# Altium schematic sheet 15 EXP_IO.SchDoc
size 513 x 386 mm
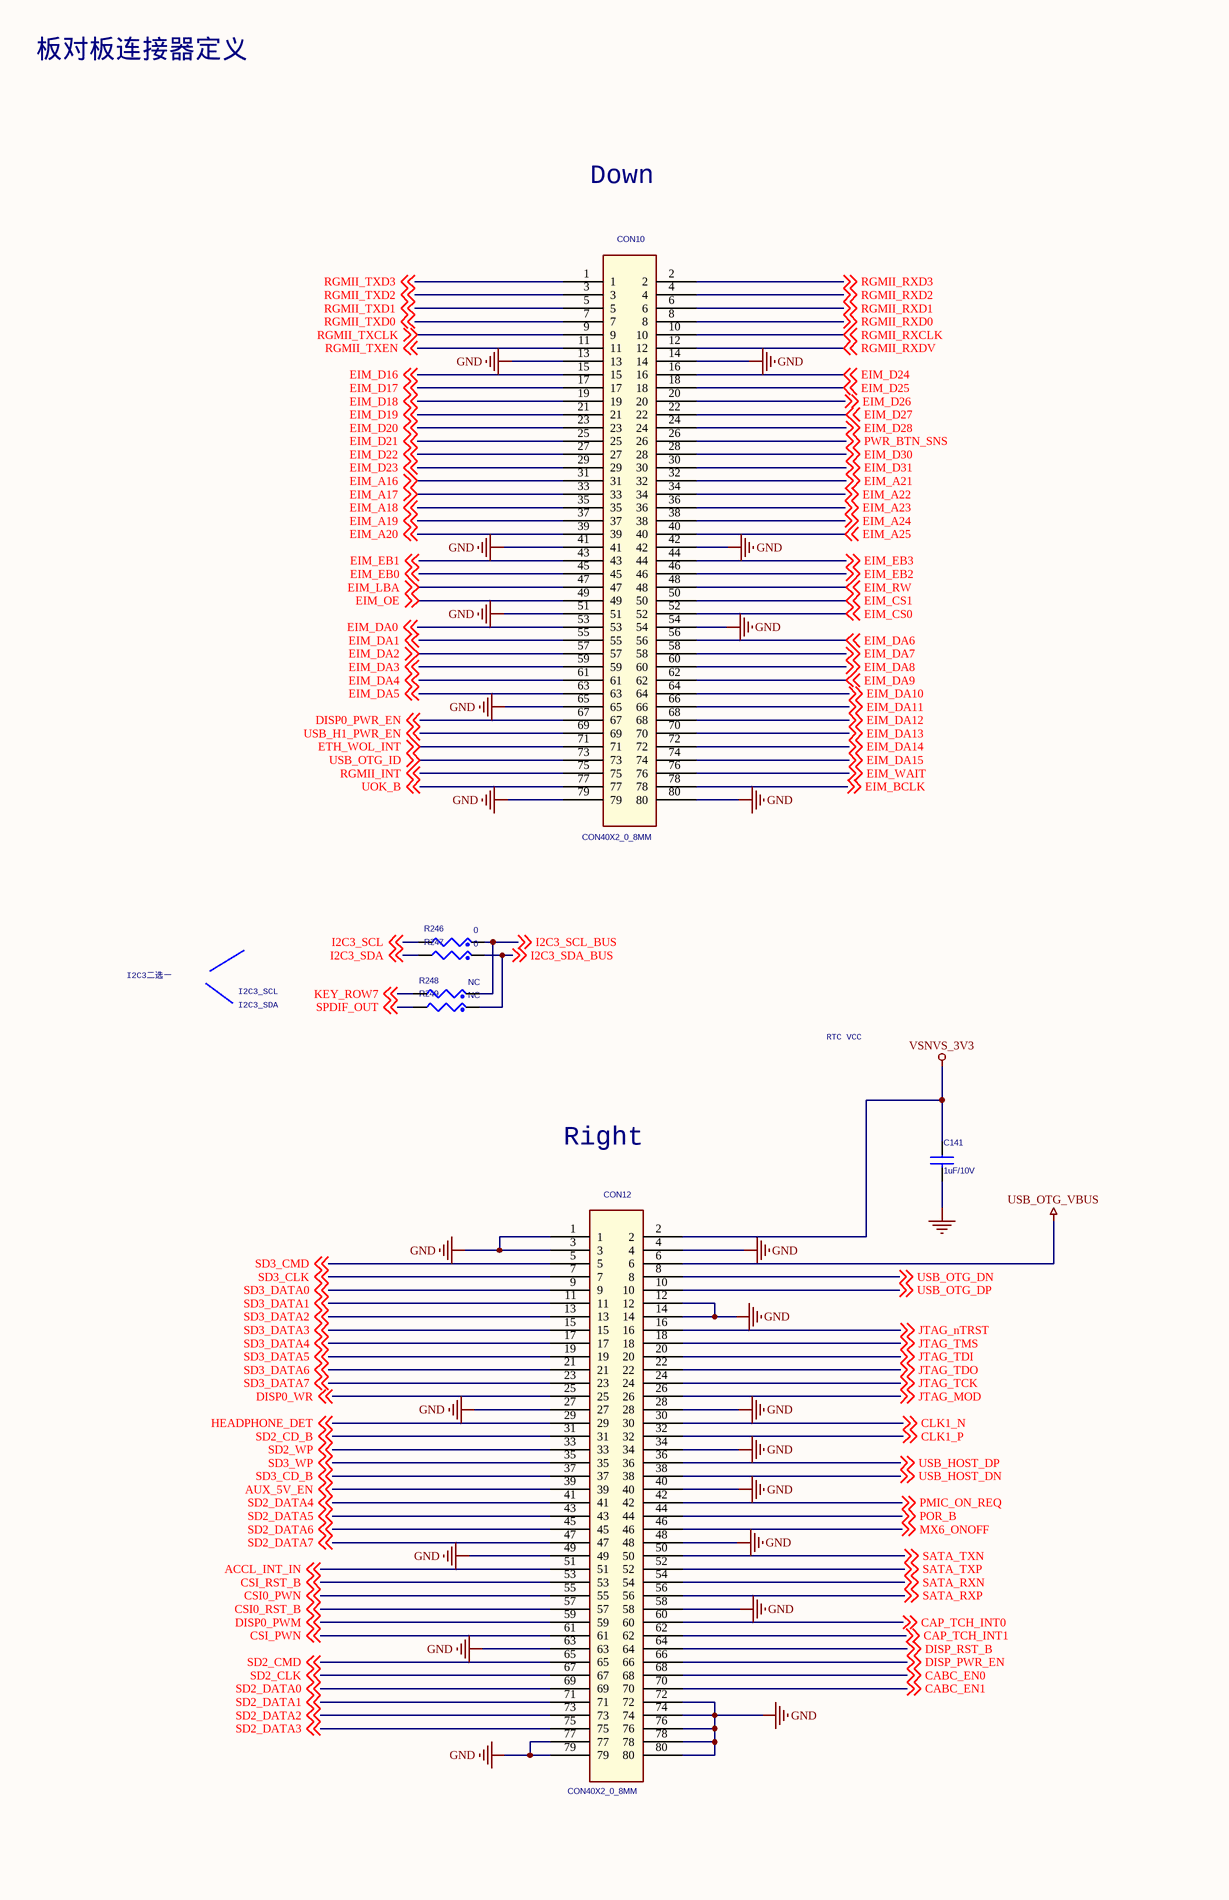
[diagram p0: 15 EXP_IO.SchDoc, left]
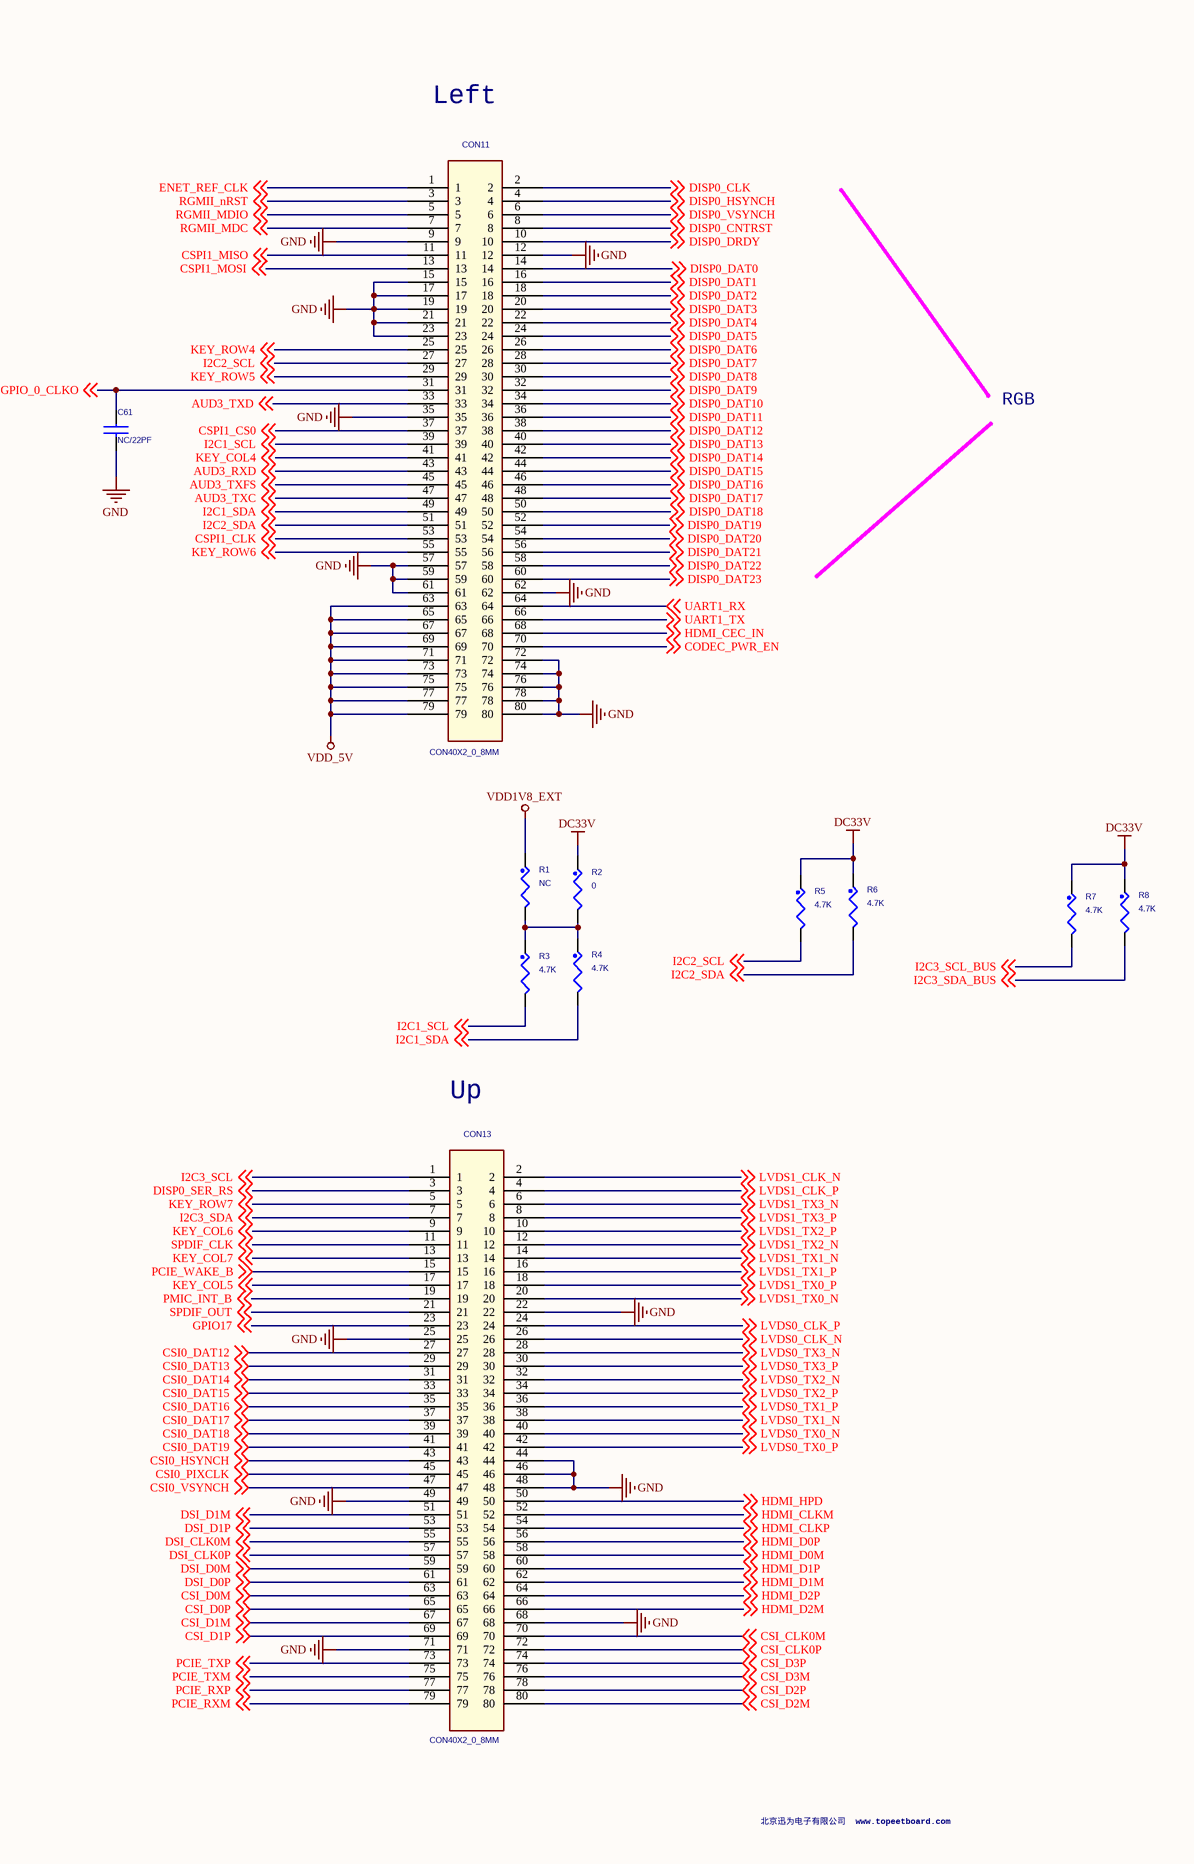
[diagram p1: 15 EXP_IO.SchDoc, right]

## Parts
C61  NC/22PF  [C0603]
C141  1uF/10V  [C0603]
CON10  CON40X2_0_8MM  [CON40X2_0_8MM]
CON11  CON40X2_0_8MM  [CON40X2_0_8MM]
CON12  CON40X2_0_8MM  [CON40X2_0_8MM]
CON13  CON40X2_0_8MM  [CON40X2_0_8MM]
R1  NC  [R0402]
R2  0  [R0402]
R3  4.7K  [R0402]
R4  4.7K  [R0402]
R5  4.7K  [R0402]
R6  4.7K  [R0402]
R7  4.7K  [R0402]
R8  4.7K  [R0402]
R246  0  [R0402]
R247  0  [R0402]
R248  NC  [R0402]
R249  NC  [R0402]

## Nets
DC33V: R2.1 R5.1 R6.1 R7.1 R8.1
GND: C61.2 C141.2 CON10.13 CON10.14 CON10.41 CON10.42 CON10.51 CON10.54 CON10.65 CON10.79 CON10.80 CON11.9 CON11.12 CON11.15 CON11.17 CON11.19 CON11.21 CON11.23 CON11.35 CON11.57 CON11.59 CON11.61 CON11.62 CON11.72 CON11.74 CON11.76 CON11.78 CON11.80 CON12.1 CON12.3 CON12.4 CON12.12 CON12.14 CON12.27 CON12.28 CON12.34 CON12.40 CON12.48 CON12.49 CON12.58 CON12.63 CON12.72 CON12.74 CON12.76 CON12.77 CON12.78 CON12.79 CON12.80 CON13.22 CON13.25 CON13.44 CON13.46 CON13.48 CON13.49 CON13.68 CON13.71
USB_OTG_VBUS: CON12.6
VDD1V8_EXT: R1.1
VDD_5V: CON11.63 CON11.65 CON11.67 CON11.69 CON11.71 CON11.73 CON11.75 CON11.77 CON11.79
VSNVS_3V3: C141.1 CON12.2
ACCL_INT_IN: CON12.51 ; off-sheet ACCL_INT_IN
AUD3_RXD: CON11.43 ; off-sheet AUD3_RXD
AUD3_TXC: CON11.47 ; off-sheet AUD3_TXC
AUD3_TXD: CON11.33 ; off-sheet AUD3_TXD
AUD3_TXFS: CON11.45 ; off-sheet AUD3_TXFS
AUX_5V_EN: CON12.39 ; off-sheet AUX_5V_EN
CABC_EN0: CON12.68 ; off-sheet CABC_EN0
CABC_EN1: CON12.70 ; off-sheet CABC_EN1
CAP_TCH_INT0: CON12.60 ; off-sheet CAP_TCH_INT0
CAP_TCH_INT1: CON12.62 ; off-sheet CAP_TCH_INT1
CLK1_N: CON12.30 ; off-sheet CLK1_N
CLK1_P: CON12.32 ; off-sheet CLK1_P
CODEC_PWR_EN: CON11.70 ; off-sheet CODEC_PWR_EN
CSI0_DAT12: CON13.27 ; off-sheet CSI0_DAT12
CSI0_DAT13: CON13.29 ; off-sheet CSI0_DAT13
CSI0_DAT14: CON13.31 ; off-sheet CSI0_DAT14
CSI0_DAT15: CON13.33 ; off-sheet CSI0_DAT15
CSI0_DAT16: CON13.35 ; off-sheet CSI0_DAT16
CSI0_DAT17: CON13.37 ; off-sheet CSI0_DAT17
CSI0_DAT18: CON13.39 ; off-sheet CSI0_DAT18
CSI0_DAT19: CON13.41 ; off-sheet CSI0_DAT19
CSI0_HSYNCH: CON13.43 ; off-sheet CSI0_HSYNCH
CSI0_PIXCLK: CON13.45 ; off-sheet CSI0_PIXCLK
CSI0_PWN: CON12.55 ; off-sheet CSI0_PWN
CSI0_RST_B: CON12.57 ; off-sheet CSI0_RST_B
CSI0_VSYNCH: CON13.47 ; off-sheet CSI0_VSYNCH
CSI_CLK0M: CON13.70 ; off-sheet CSI_CLK0M
CSI_CLK0P: CON13.72 ; off-sheet CSI_CLK0P
CSI_D0M: CON13.63 ; off-sheet CSI_D0M
CSI_D0P: CON13.65 ; off-sheet CSI_D0P
CSI_D1M: CON13.67 ; off-sheet CSI_D1M
CSI_D1P: CON13.69 ; off-sheet CSI_D1P
CSI_D2M: CON13.80 ; off-sheet CSI_D2M
CSI_D2P: CON13.78 ; off-sheet CSI_D2P
CSI_D3M: CON13.76 ; off-sheet CSI_D3M
CSI_D3P: CON13.74 ; off-sheet CSI_D3P
CSI_PWN: CON12.61 ; off-sheet CSI_PWN
CSI_RST_B: CON12.53 ; off-sheet CSI_RST_B
CSPI1_CLK: CON11.53 ; off-sheet CSPI1_CLK
CSPI1_CS0: CON11.37 ; off-sheet CSPI1_CS0
CSPI1_MISO: CON11.11 ; off-sheet CSPI1_MISO
CSPI1_MOSI: CON11.13 ; off-sheet CSPI1_MOSI
DISP0_CLK: CON11.2 ; off-sheet DISP0_CLK
DISP0_CNTRST: CON11.8 ; off-sheet DISP0_CNTRST
DISP0_DAT0: CON11.14 ; off-sheet DISP0_DAT0
DISP0_DAT1: CON11.16 ; off-sheet DISP0_DAT1
DISP0_DAT2: CON11.18 ; off-sheet DISP0_DAT2
DISP0_DAT3: CON11.20 ; off-sheet DISP0_DAT3
DISP0_DAT4: CON11.22 ; off-sheet DISP0_DAT4
DISP0_DAT5: CON11.24 ; off-sheet DISP0_DAT5
DISP0_DAT6: CON11.26 ; off-sheet DISP0_DAT6
DISP0_DAT7: CON11.28 ; off-sheet DISP0_DAT7
DISP0_DAT8: CON11.30 ; off-sheet DISP0_DAT8
DISP0_DAT9: CON11.32 ; off-sheet DISP0_DAT9
DISP0_DAT10: CON11.34 ; off-sheet DISP0_DAT10
DISP0_DAT11: CON11.36 ; off-sheet DISP0_DAT11
DISP0_DAT12: CON11.38 ; off-sheet DISP0_DAT12
DISP0_DAT13: CON11.40 ; off-sheet DISP0_DAT13
DISP0_DAT14: CON11.42 ; off-sheet DISP0_DAT14
DISP0_DAT15: CON11.44 ; off-sheet DISP0_DAT15
DISP0_DAT16: CON11.46 ; off-sheet DISP0_DAT16
DISP0_DAT17: CON11.48 ; off-sheet DISP0_DAT17
DISP0_DAT18: CON11.50 ; off-sheet DISP0_DAT18
DISP0_DAT19: CON11.52 ; off-sheet DISP0_DAT19
DISP0_DAT20: CON11.54 ; off-sheet DISP0_DAT20
DISP0_DAT21: CON11.56 ; off-sheet DISP0_DAT21
DISP0_DAT22: CON11.58 ; off-sheet DISP0_DAT22
DISP0_DAT23: CON11.60 ; off-sheet DISP0_DAT23
DISP0_DRDY: CON11.10 ; off-sheet DISP0_DRDY
DISP0_HSYNCH: CON11.4 ; off-sheet DISP0_HSYNCH
DISP0_PWM: CON12.59 ; off-sheet DISP0_PWM
DISP0_PWR_EN: CON10.67 ; off-sheet DISP0_PWR_EN
DISP0_SER_RS: CON13.3 ; off-sheet DISP0_SER_RS
DISP0_VSYNCH: CON11.6 ; off-sheet DISP0_VSYNCH
DISP0_WR: CON12.25 ; off-sheet DISP0_WR
DISP_PWR_EN: CON12.66 ; off-sheet DISP_PWR_EN
DISP_RST_B: CON12.64 ; off-sheet DISP_RST_B
DSI_CLK0M: CON13.55 ; off-sheet DSI_CLK0M
DSI_CLK0P: CON13.57 ; off-sheet DSI_CLK0P
DSI_D0M: CON13.59 ; off-sheet DSI_D0M
DSI_D0P: CON13.61 ; off-sheet DSI_D0P
DSI_D1M: CON13.51 ; off-sheet DSI_D1M
DSI_D1P: CON13.53 ; off-sheet DSI_D1P
EIM_A16: CON10.31 ; off-sheet EIM_A16
EIM_A17: CON10.33 ; off-sheet EIM_A17
EIM_A18: CON10.35 ; off-sheet EIM_A18
EIM_A19: CON10.37 ; off-sheet EIM_A19
EIM_A20: CON10.39 ; off-sheet EIM_A20
EIM_A21: CON10.32 ; off-sheet EIM_A21
EIM_A22: CON10.34 ; off-sheet EIM_A22
EIM_A23: CON10.36 ; off-sheet EIM_A23
EIM_A24: CON10.38 ; off-sheet EIM_A24
EIM_A25: CON10.40 ; off-sheet EIM_A25
EIM_BCLK: CON10.78 ; off-sheet EIM_BCLK
EIM_CS0: CON10.52 ; off-sheet EIM_CS0
EIM_CS1: CON10.50 ; off-sheet EIM_CS1
EIM_D16: CON10.15 ; off-sheet EIM_D16
EIM_D17: CON10.17 ; off-sheet EIM_D17
EIM_D18: CON10.19 ; off-sheet EIM_D18
EIM_D19: CON10.21 ; off-sheet EIM_D19
EIM_D20: CON10.23 ; off-sheet EIM_D20
EIM_D21: CON10.25 ; off-sheet EIM_D21
EIM_D22: CON10.27 ; off-sheet EIM_D22
EIM_D23: CON10.29 ; off-sheet EIM_D23
EIM_D24: CON10.16 ; off-sheet EIM_D24
EIM_D25: CON10.18 ; off-sheet EIM_D25
EIM_D26: CON10.20 ; off-sheet EIM_D26
EIM_D27: CON10.22 ; off-sheet EIM_D27
EIM_D28: CON10.24 ; off-sheet EIM_D28
EIM_D30: CON10.28 ; off-sheet EIM_D30
EIM_D31: CON10.30 ; off-sheet EIM_D31
EIM_DA0: CON10.53 ; off-sheet EIM_DA0
EIM_DA1: CON10.55 ; off-sheet EIM_DA1
EIM_DA2: CON10.57 ; off-sheet EIM_DA2
EIM_DA3: CON10.59 ; off-sheet EIM_DA3
EIM_DA4: CON10.61 ; off-sheet EIM_DA4
EIM_DA5: CON10.63 ; off-sheet EIM_DA5
EIM_DA6: CON10.56 ; off-sheet EIM_DA6
EIM_DA7: CON10.58 ; off-sheet EIM_DA7
EIM_DA8: CON10.60 ; off-sheet EIM_DA8
EIM_DA9: CON10.62 ; off-sheet EIM_DA9
EIM_DA10: CON10.64 ; off-sheet EIM_DA10
EIM_DA11: CON10.66 ; off-sheet EIM_DA11
EIM_DA12: CON10.68 ; off-sheet EIM_DA12
EIM_DA13: CON10.70 ; off-sheet EIM_DA13
EIM_DA14: CON10.72 ; off-sheet EIM_DA14
EIM_DA15: CON10.74 ; off-sheet EIM_DA15
EIM_EB0: CON10.45 ; off-sheet EIM_EB0
EIM_EB1: CON10.43 ; off-sheet EIM_EB1
EIM_EB2: CON10.46 ; off-sheet EIM_EB2
EIM_EB3: CON10.44 ; off-sheet EIM_EB3
EIM_LBA: CON10.47 ; off-sheet EIM_LBA
EIM_OE: CON10.49 ; off-sheet EIM_OE
EIM_RW: CON10.48 ; off-sheet EIM_RW
EIM_WAIT: CON10.76 ; off-sheet EIM_WAIT
ENET_REF_CLK: CON11.1 ; off-sheet ENET_REF_CLK
ETH_WOL_INT: CON10.71 ; off-sheet ETH_WOL_INT
GPIO17: CON13.23 ; off-sheet GPIO17
GPIO_0_CLKO: C61.1 CON11.31 ; off-sheet GPIO_0_CLKO
HDMI_CEC_IN: CON11.68 ; off-sheet HDMI_CEC_IN
HDMI_CLKM: CON13.52 ; off-sheet HDMI_CLKM
HDMI_CLKP: CON13.54 ; off-sheet HDMI_CLKP
HDMI_D0M: CON13.58 ; off-sheet HDMI_D0M
HDMI_D0P: CON13.56 ; off-sheet HDMI_D0P
HDMI_D1M: CON13.62 ; off-sheet HDMI_D1M
HDMI_D1P: CON13.60 ; off-sheet HDMI_D1P
HDMI_D2M: CON13.66 ; off-sheet HDMI_D2M
HDMI_D2P: CON13.64 ; off-sheet HDMI_D2P
HDMI_HPD: CON13.50 ; off-sheet HDMI_HPD
HEADPHONE_DET: CON12.29 ; off-sheet HEADPHONE_DET
I2C1_SCL: CON11.39 R3.2 ; off-sheet I2C1_SCL
I2C1_SDA: CON11.49 R4.2 ; off-sheet I2C1_SDA
I2C2_SCL: CON11.27 R5.2 ; off-sheet I2C2_SCL
I2C2_SDA: CON11.51 R6.2 ; off-sheet I2C2_SDA
I2C3_SCL: CON13.1 R246.2 ; off-sheet I2C3_SCL
I2C3_SCL_BUS: R7.2 R246.1 R248.1 ; off-sheet I2C3_SCL_BUS
I2C3_SDA: CON13.7 R247.2 ; off-sheet I2C3_SDA
I2C3_SDA_BUS: R8.2 R247.1 R249.1 ; off-sheet I2C3_SDA_BUS
JTAG_MOD: CON12.26 ; off-sheet JTAG_MOD
JTAG_nTRST: CON12.16 ; off-sheet JTAG_nTRST
JTAG_TCK: CON12.24 ; off-sheet JTAG_TCK
JTAG_TDI: CON12.20 ; off-sheet JTAG_TDI
JTAG_TDO: CON12.22 ; off-sheet JTAG_TDO
JTAG_TMS: CON12.18 ; off-sheet JTAG_TMS
KEY_COL4: CON11.41 ; off-sheet KEY_COL4
KEY_COL5: CON13.17 ; off-sheet KEY_COL5
KEY_COL6: CON13.9 ; off-sheet KEY_COL6
KEY_COL7: CON13.13 ; off-sheet KEY_COL7
KEY_ROW4: CON11.25 ; off-sheet KEY_ROW4
KEY_ROW5: CON11.29 ; off-sheet KEY_ROW5
KEY_ROW6: CON11.55 ; off-sheet KEY_ROW6
KEY_ROW7: CON13.5 R248.2 ; off-sheet KEY_ROW7
LVDS0_CLK_N: CON13.26 ; off-sheet LVDS0_CLK_N
LVDS0_CLK_P: CON13.24 ; off-sheet LVDS0_CLK_P
LVDS0_TX0_N: CON13.40 ; off-sheet LVDS0_TX0_N
LVDS0_TX0_P: CON13.42 ; off-sheet LVDS0_TX0_P
LVDS0_TX1_N: CON13.38 ; off-sheet LVDS0_TX1_N
LVDS0_TX1_P: CON13.36 ; off-sheet LVDS0_TX1_P
LVDS0_TX2_N: CON13.32 ; off-sheet LVDS0_TX2_N
LVDS0_TX2_P: CON13.34 ; off-sheet LVDS0_TX2_P
LVDS0_TX3_N: CON13.28 ; off-sheet LVDS0_TX3_N
LVDS0_TX3_P: CON13.30 ; off-sheet LVDS0_TX3_P
LVDS1_CLK_N: CON13.2 ; off-sheet LVDS1_CLK_N
LVDS1_CLK_P: CON13.4 ; off-sheet LVDS1_CLK_P
LVDS1_TX0_N: CON13.20 ; off-sheet LVDS1_TX0_N
LVDS1_TX0_P: CON13.18 ; off-sheet LVDS1_TX0_P
LVDS1_TX1_N: CON13.14 ; off-sheet LVDS1_TX1_N
LVDS1_TX1_P: CON13.16 ; off-sheet LVDS1_TX1_P
LVDS1_TX2_N: CON13.12 ; off-sheet LVDS1_TX2_N
LVDS1_TX2_P: CON13.10 ; off-sheet LVDS1_TX2_P
LVDS1_TX3_N: CON13.6 ; off-sheet LVDS1_TX3_N
LVDS1_TX3_P: CON13.8 ; off-sheet LVDS1_TX3_P
MX6_ONOFF: CON12.46 ; off-sheet MX6_ONOFF
PCIE_RXM: CON13.79 ; off-sheet PCIE_RXM
PCIE_RXP: CON13.77 ; off-sheet PCIE_RXP
PCIE_TXM: CON13.75 ; off-sheet PCIE_TXM
PCIE_TXP: CON13.73 ; off-sheet PCIE_TXP
PCIE_WAKE_B: CON13.15 ; off-sheet PCIE_WAKE_B
PMIC_INT_B: CON13.19 ; off-sheet PMIC_INT_B
PMIC_ON_REQ: CON12.42 ; off-sheet PMIC_ON_REQ
POR_B: CON12.44 ; off-sheet POR_B
PWR_BTN_SNS: CON10.26 ; off-sheet PWR_BTN_SNS
RGMII_INT: CON10.75 ; off-sheet RGMII_INT
RGMII_MDC: CON11.7 ; off-sheet RGMII_MDC
RGMII_MDIO: CON11.5 ; off-sheet RGMII_MDIO
RGMII_nRST: CON11.3 ; off-sheet RGMII_nRST
RGMII_RXCLK: CON10.10 ; off-sheet RGMII_RXCLK
RGMII_RXD0: CON10.8 ; off-sheet RGMII_RXD0
RGMII_RXD1: CON10.6 ; off-sheet RGMII_RXD1
RGMII_RXD2: CON10.4 ; off-sheet RGMII_RXD2
RGMII_RXD3: CON10.2 ; off-sheet RGMII_RXD3
RGMII_RXDV: CON10.12 ; off-sheet RGMII_RXDV
RGMII_TXCLK: CON10.9 ; off-sheet RGMII_TXCLK
RGMII_TXD0: CON10.7 ; off-sheet RGMII_TXD0
RGMII_TXD1: CON10.5 ; off-sheet RGMII_TXD1
RGMII_TXD2: CON10.3 ; off-sheet RGMII_TXD2
RGMII_TXD3: CON10.1 ; off-sheet RGMII_TXD3
RGMII_TXEN: CON10.11 ; off-sheet RGMII_TXEN
SATA_RXN: CON12.54 ; off-sheet SATA_RXN
SATA_RXP: CON12.56 ; off-sheet SATA_RXP
SATA_TXN: CON12.50 ; off-sheet SATA_TXN
SATA_TXP: CON12.52 ; off-sheet SATA_TXP
SD2_CD_B: CON12.31 ; off-sheet SD2_CD_B
SD2_CLK: CON12.67 ; off-sheet SD2_CLK
SD2_CMD: CON12.65 ; off-sheet SD2_CMD
SD2_DATA0: CON12.69 ; off-sheet SD2_DATA0
SD2_DATA1: CON12.71 ; off-sheet SD2_DATA1
SD2_DATA2: CON12.73 ; off-sheet SD2_DATA2
SD2_DATA3: CON12.75 ; off-sheet SD2_DATA3
SD2_DATA4: CON12.41 ; off-sheet SD2_DATA4
SD2_DATA5: CON12.43 ; off-sheet SD2_DATA5
SD2_DATA6: CON12.45 ; off-sheet SD2_DATA6
SD2_DATA7: CON12.47 ; off-sheet SD2_DATA7
SD2_WP: CON12.33 ; off-sheet SD2_WP
SD3_CD_B: CON12.37 ; off-sheet SD3_CD_B
SD3_CLK: CON12.7 ; off-sheet SD3_CLK
SD3_CMD: CON12.5 ; off-sheet SD3_CMD
SD3_DATA0: CON12.9 ; off-sheet SD3_DATA0
SD3_DATA1: CON12.11 ; off-sheet SD3_DATA1
SD3_DATA2: CON12.13 ; off-sheet SD3_DATA2
SD3_DATA3: CON12.15 ; off-sheet SD3_DATA3
SD3_DATA4: CON12.17 ; off-sheet SD3_DATA4
SD3_DATA5: CON12.19 ; off-sheet SD3_DATA5
SD3_DATA6: CON12.21 ; off-sheet SD3_DATA6
SD3_DATA7: CON12.23 ; off-sheet SD3_DATA7
SD3_WP: CON12.35 ; off-sheet SD3_WP
SPDIF_CLK: CON13.11 ; off-sheet SPDIF_CLK
SPDIF_OUT: CON13.21 R249.2 ; off-sheet SPDIF_OUT
UART1_RX: CON11.64 ; off-sheet UART1_RX
UART1_TX: CON11.66 ; off-sheet UART1_TX
UOK_B: CON10.77 ; off-sheet UOK_B
USB_H1_PWR_EN: CON10.69 ; off-sheet USB_H1_PWR_EN
USB_HOST_DN: CON12.38 ; off-sheet USB_HOST_DN
USB_HOST_DP: CON12.36 ; off-sheet USB_HOST_DP
USB_OTG_DN: CON12.8 ; off-sheet USB_OTG_DN
USB_OTG_DP: CON12.10 ; off-sheet USB_OTG_DP
USB_OTG_ID: CON10.73 ; off-sheet USB_OTG_ID
NetR1_2: R1.2 R2.2 R3.1 R4.1

## Notes on the sheet
- 板对板连接器定义
- Down
- Left
- RGB
- I2C3二选一
- I2C3_SCL
- I2C3_SDA
- RTC VCC
- Right
- Up
- 北京迅为电子有限公司  www.topeetboard.com

## Library data of the parts
C61 C141 = C0603_0_Dup1
R1 R2 = RES_Dup1: RES MF ZERO OHM 1/10W -- 0402; AGILE_PN: 470-79965; MFG_NAME01: Panasonic; MFG_PN01: ERJ-2GE0R00X; ASSY_OPT: DNP; CAD_APPROVED: Yes; FPLIST: RC0402_25,RC0402_HD,RC0402_X2,0402_CC; SIGNAL_MODEL: DEFAULT_RESISTOR_0.001OHM_2_1
  R2: ROHS: Yes
R3-R8 = RES_Dup1: RES MF ZERO OHM 1/10W -- 0402; SIGNAL_MODEL: DEFAULT_RESISTOR_0.001OHM_2_1; FPLIST: RC0402_25,RC0402_HD,RC0402_X2,0402_CC; CAD_APPROVED: Yes; ASSY_OPT: DNP; MFG_PN01: ERJ-2GE0R00X; MFG_NAME01: Panasonic; AGILE_PN: 470-79965; ROHS: Yes
R246 R249 = RES_Dup1: RES MF 33 OHM 1/16W 5% 0402; AGILE_PN: 470-75634; TOL: 1%; MFG_NAME01: SMEC; MFG_PN01: RC73L2Z330JTF; CAD_APPROVED: Yes; FPLIST: RC0402_25,RC0402_HD,0402_CC; SIGNAL_MODEL: DEFAULT_RESISTOR_33OHM_2_1; ROHS: Yes; HEIGHT: 0.55 mm; Tolerance: 5%
R247 R248 = RES_Dup1: RES MF 33 OHM 1/16W 5% 0402; SIGNAL_MODEL: DEFAULT_RESISTOR_33OHM_2_1; FPLIST: RC0402_25,RC0402_HD,0402_CC; CAD_APPROVED: Yes; MFG_PN01: RC73L2Z330JTF; MFG_NAME01: SMEC; TOL: 1%; AGILE_PN: 470-75634; Tolerance: 5%; HEIGHT: 0.55 mm; ROHS: Yes